# Altium project control.PrjPCB
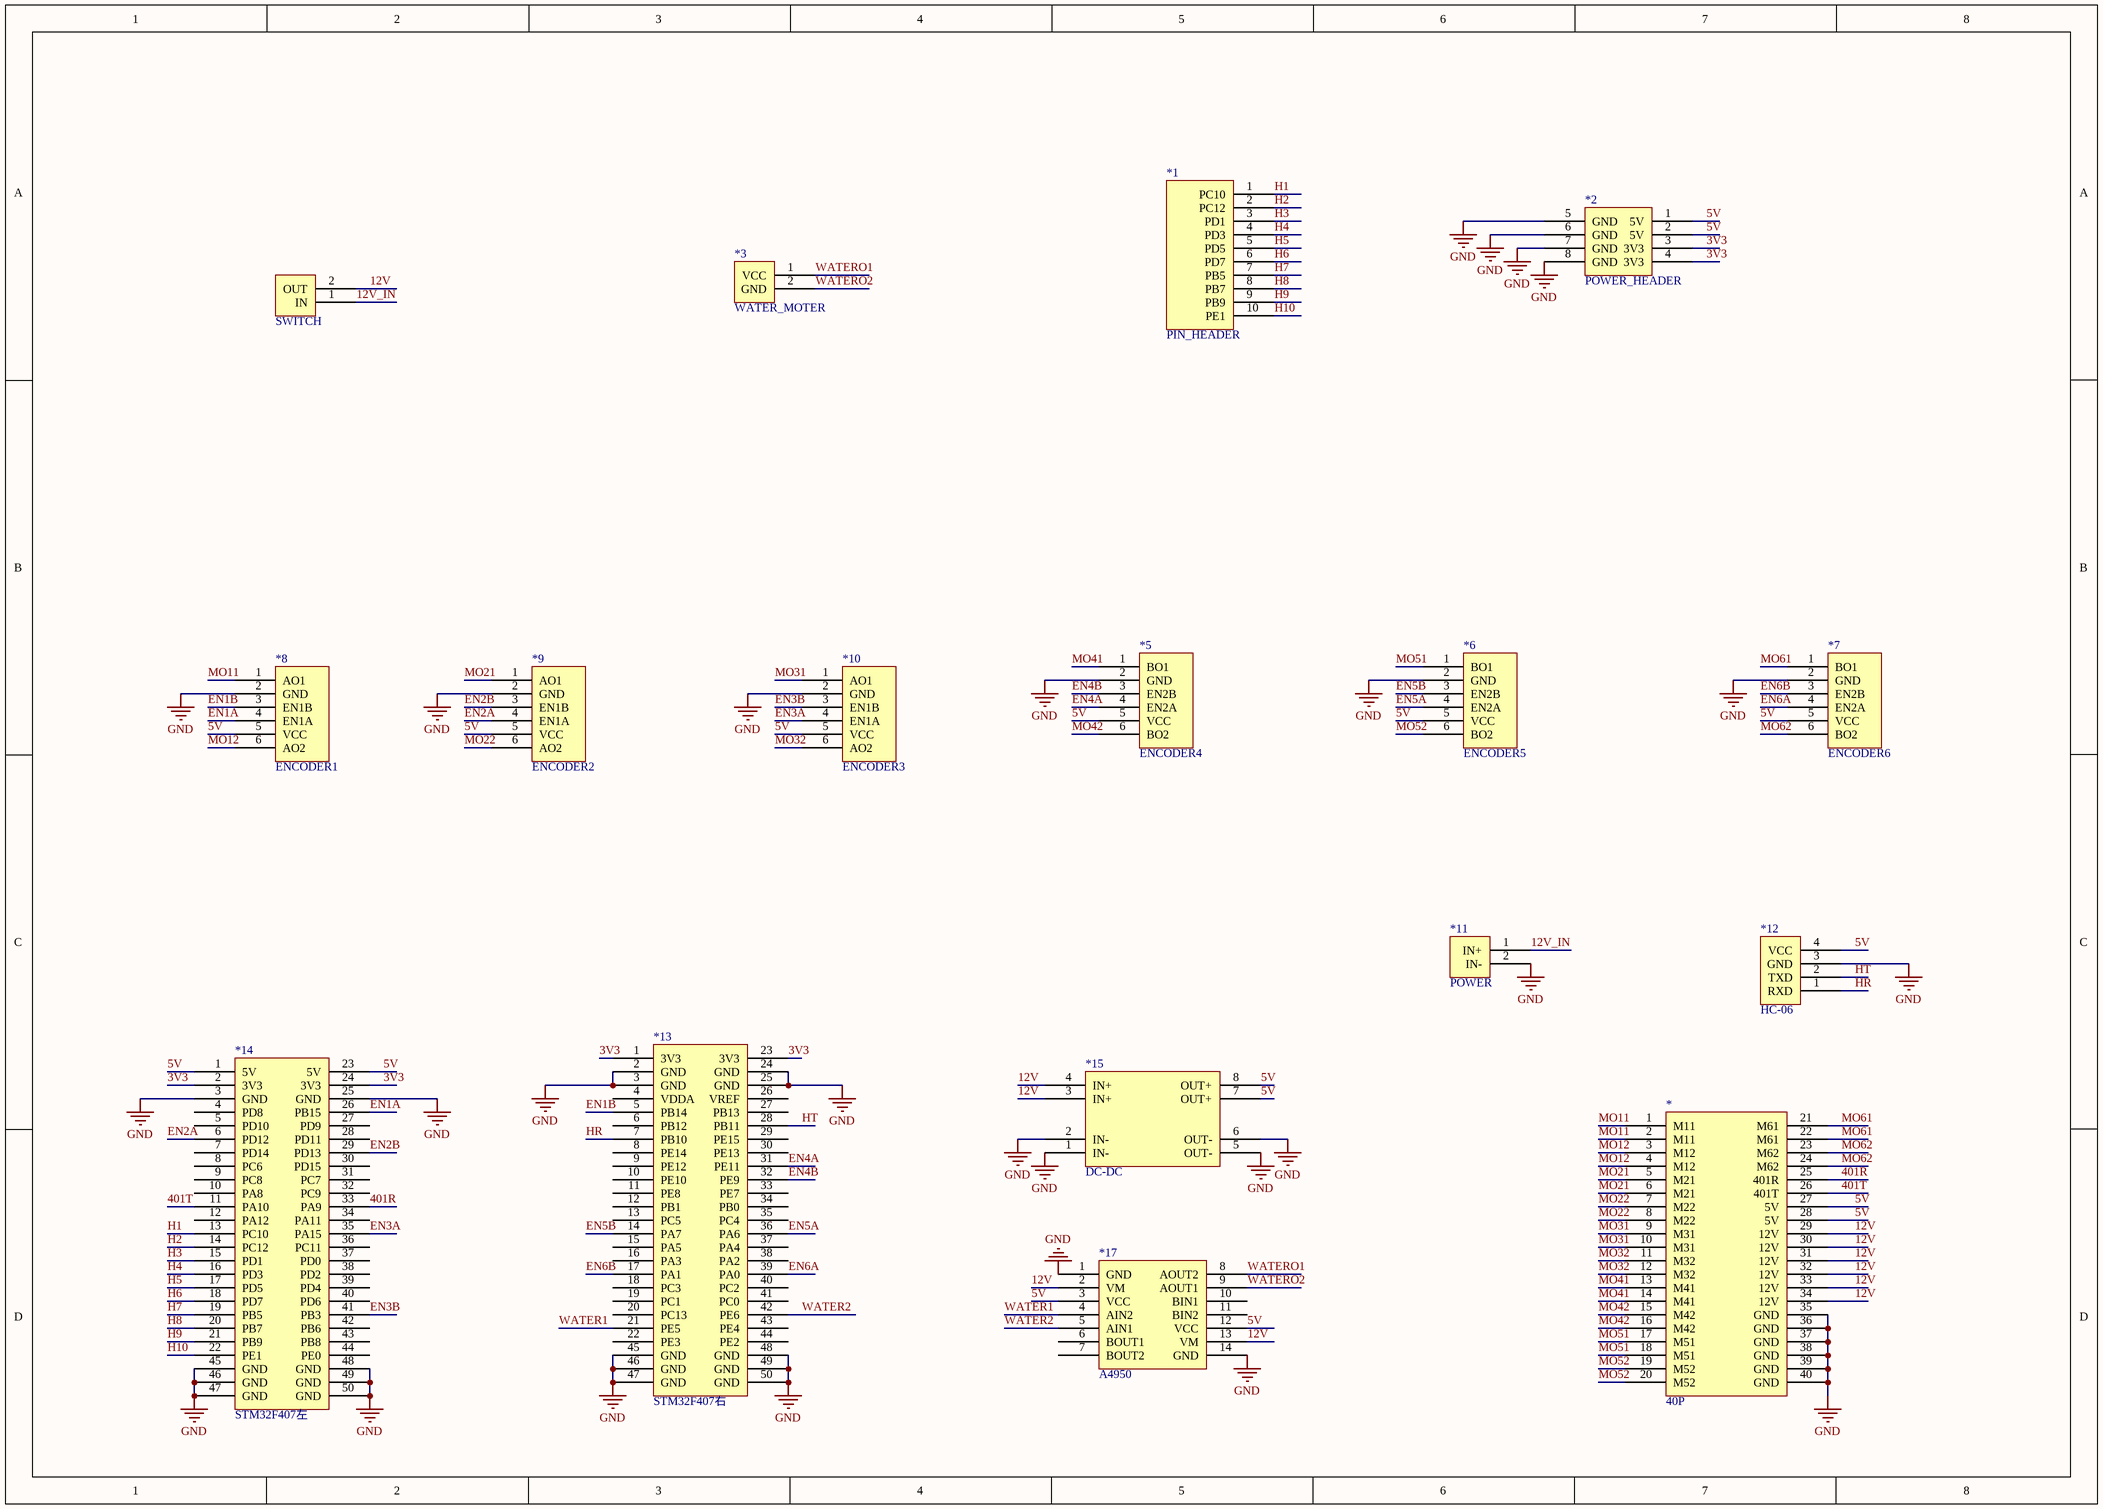
[diagram p0: 控制板原理图.SchDoc]
1 sheet, 17 parts. Net scope: global (net labels, ports and power ports of the same name join across sheets).
Board file: 控制板PCB.PcbDoc

## Sheet 控制板原理图.SchDoc
size A3

### Parts
*  40P  [PCBComponent_1]
*1  PIN_HEADER  [PIN_HEADER]
*2  POWER_HEADER  [POWER_HEADER]
*3  WATER_MOTER  [WATER_HEADER]
*5  ENCODER4  [ENCODER2]
*6  ENCODER5  [ENCODER2]
*7  ENCODER6  [ENCODER2]
*8  ENCODER1  [ENCODER1]
*9  ENCODER2  [ENCODER1]
*10  ENCODER3  [ENCODER1]
*11  POWER  [POWER]
*12  HC-06  [HC-06]
*13  STM32F407右  [STM32F407左]
*14  STM32F407左  [STM32F407左]
*15  DC-DC  [DC-DC]
*17  A4950  [A4950]
  SWITCH  [switch]

### Nets
GND: *.35(GND) *.36(GND) *.37(GND) *.38(GND) *.39(GND) *.40(GND) *2.5(GND) *2.6(GND) *2.7(GND) *2.8(GND) *5.2(GND) *6.2(GND) *7.2(GND) *8.2(GND) *9.2(GND) *10.2(GND) *11.2(IN-) *12.3(GND) *13.2(GND) *13.3(GND) *13.24(GND) *13.25(GND) *13.45(GND) *13.46(GND) *13.47(GND) *13.48(GND) *13.49(GND) *13.50(GND) *14.3(GND) *14.25(GND) *14.45(GND) *14.46(GND) *14.47(GND) *14.48(GND) *14.49(GND) *14.50(GND) *15.1(IN-) *15.2(IN-) *15.5(OUT-) *15.6(OUT-) *17.1(GND) *17.14(GND)
3V3: *2.3(3V3) *2.4(3V3) *13.1(3V3) *13.23(3V3) *14.2(3V3) *14.24(3V3)
5V: *.27(5V) *.28(5V) *2.1(5V) *2.2(5V) *5.5(VCC) *6.5(VCC) *7.5(VCC) *8.5(VCC) *9.5(VCC) *10.5(VCC) *12.4(VCC) *14.1(5V) *14.23(5V) *15.7(OUT+) *15.8(OUT+) *17.3(VCC) *17.12(VCC)
12V: *.29(12V) *.30(12V) *.31(12V) *.32(12V) *.33(12V) *.34(12V) *15.3(IN+) *15.4(IN+) *17.2(VM) *17.13(VM) .2(OUT)
12V_IN: *11.1(IN+) .1(IN)
401R: *.25(401R) *14.33(PA9)
401T: *.26(401T) *14.11(PA10)
EN1A: *8.4(EN1A) *14.26(PB15)
EN1B: *8.3(EN1B) *13.5(PB14)
EN2A: *9.4(EN1A) *14.6(PD12)
EN2B: *9.3(EN1B) *14.29(PD13)
EN3A: *10.4(EN1A) *14.35(PA15)
EN3B: *10.3(EN1B) *14.41(PB3)
EN4A: *5.4(EN2A) *13.31(PE11)
EN4B: *5.3(EN2B) *13.32(PE9)
EN5A: *6.4(EN2A) *13.36(PA6)
EN5B: *6.3(EN2B) *13.14(PA7)
EN6A: *7.4(EN2A) *13.39(PA0)
EN6B: *7.3(EN2B) *13.17(PA1)
H1: *1.1(PC10) *14.13(PC10)
H2: *1.2(PC12) *14.14(PC12)
H3: *1.3(PD1) *14.15(PD1)
H4: *1.4(PD3) *14.16(PD3)
H5: *1.5(PD5) *14.17(PD5)
H6: *1.6(PD7) *14.18(PD7)
H7: *1.7(PB5) *14.19(PB5)
H8: *1.8(PB7) *14.20(PB7)
H9: *1.9(PB9) *14.21(PB9)
H10: *1.10(PE1) *14.22(PE1)
HR: *12.1(RXD) *13.7(PB10)
HT: *12.2(TXD) *13.28(PB11)
MO11: *.1(M11) *.2(M11) *8.1(AO1)
MO12: *.3(M12) *.4(M12) *8.6(AO2)
MO21: *.5(M21) *.6(M21) *9.1(AO1)
MO22: *.7(M22) *.8(M22) *9.6(AO2)
MO31: *.9(M31) *.10(M31) *10.1(AO1)
MO32: *.11(M32) *.12(M32) *10.6(AO2)
MO41: *.13(M41) *.14(M41) *5.1(BO1)
MO42: *.15(M42) *.16(M42) *5.6(BO2)
MO51: *.17(M51) *.18(M51) *6.1(BO1)
MO52: *.19(M52) *.20(M52) *6.6(BO2)
MO61: *.21(M61) *.22(M61) *7.1(BO1)
MO62: *.23(M62) *.24(M62) *7.6(BO2)
WATER1: *13.21(PE5) *17.4(AIN2)
WATER2: *13.42(PE6) *17.5(AIN1)
WATERO1: *3.1(VCC) *17.8(AOUT2)
WATERO2: *3.2(GND) *17.9(AOUT1)

Not connected (* = marked no-connect by the designer): *13 4(VDDA) 6(PB12) 8(PE14) 9(PE12) 10(PE10) 11(PE8) 12(PB1) 13(PC5) 15(PA5) 16(PA3) 18(PC3) 19(PC1) 20(PC13) 22(PE3) 26(VREF) 27(PB13) 29(PE15) 30(PE13) 33(PE7) 34(PB0) 35(PC4) 37(PA4) 38(PA2) 40(PC2) 41(PC0) 43(PE4) 44(PE2); *14 4(PD8) 5(PD10) 7(PD14) 8(PC6) 9(PC8) 10(PA8) 12(PA12) 27(PD9) 28(PD11) 30(PD15) 31(PC7) 32(PC9) 34(PA11) 36(PC11) 37(PD0) 38(PD2) 39(PD4) 40(PD6) 42(PB6) 43(PB8) 44(PE0); *17 6(BOUT1) 7(BOUT2) 10(BIN1) 11(BIN2)